# Altium schematic sheet MHT192UGCT1_MHT192UGCT.schdoc
size 127 x 99 mm
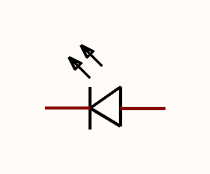
[diagram p0: MHT192UGCT1_MHT192UGCT.schdoc]

## Parts
LED?  MHT192UGCT  [LED0603-RD_GREEN]  (value not drawn)

## Nets

Not connected (* = marked no-connect by the designer): LED? 1(-) 2(+)

## Library data of the parts
LED? = MHT192UGCT: Manufacturer: MEIHUA(美华); Add into BOM: yes; Emitted Color: 翠绿色; Power Dissipation: 60mW; Forward Current: 20mA; Dominant Wavelength: 515nm~530nm; Peak Wavelength: 518nm; Lens Color: 无色透明透镜; Viewing Angle: 120°; Symbol: MHT192UGCT; Device: MHT192UGCT; LCSC Part Name: 翠绿; Supplier Part: C389519; Manufacturer Part: MHT192UGCT; Supplier Footprint: 0603; JLCPCB Part Class: Extended Part; Datasheet: https://atta.szlcsc.com/upload/public/pdf/source/20190515/C389519_7BC27E831414348C8AF19AF18EE4BF58.pdf; Supplier: LCSC; Convert to PCB: yes; Diode Configuration: -; Color Temperature: -; Mounting Sytle: -; Operating Temperature: -40℃~+85℃